# EAGLE design relay_Board (EAGLE 8.0.0)
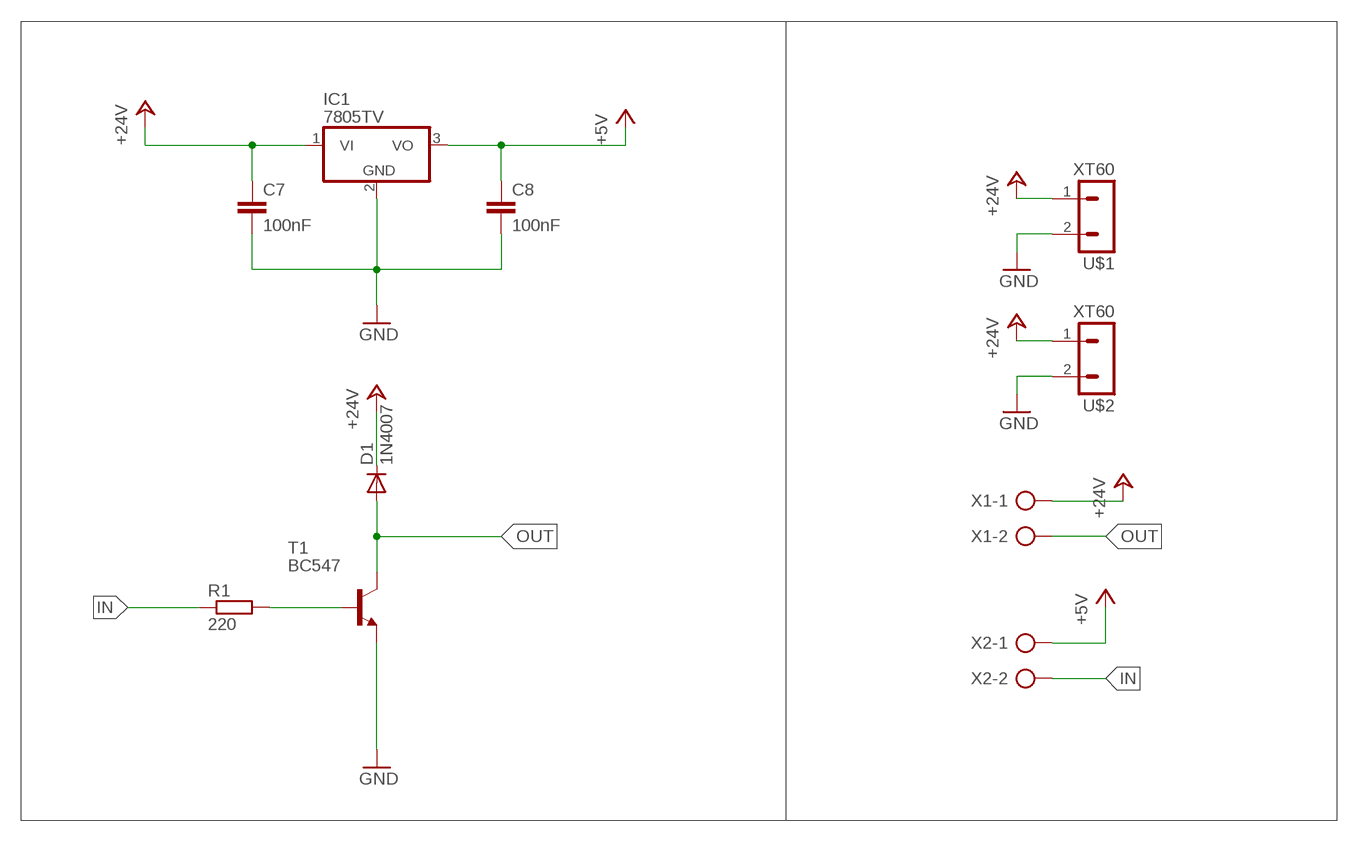
[diagram p0: schematic, sheet 1]

## Parts
C7  100nF  C5/5  [C5B5]
C8  100nF  C5/5  [C5B5]
D1  1N4007  DIODE  [DIODE]
IC1  7805TV  [TO220V]
R1  220  RES  [0207/10]
T1  BC547  [TO92]
U$1  XT60  [XT60]
U$2  XT60  [XT60]
X1  AK500/2  [AK500/2]
X2  AK500/2  [AK500/2]

## Nets
+5V [usbvcc]: C8.1 IC1.3(VO) X2.1
+24V: C7.1 D1.C IC1.1(VI) U$1.1 U$2.1 X1.1
GND: C7.2 C8.2 IC1.2(GND) T1.1(E) U$1.2 U$2.2
IN: R1.1 X2.2
N$1: R1.2 T1.2(B)
OUT: D1.A T1.3(C) X1.2

## Library data of the parts
C7 C8 = capacitor-wima:C: CAPACITOR naming: grid - package width
D1 = ZYBOTS:DIODE
IC1 = linear:78*: Positive VOLTAGE REGULATOR Source: http://cache.national.com/ds/LM/LM78L05.pdf http://www.fairchildsemi.com/ds/LM/LM7805.pdf
R1 = ZYBOTS:RES
T1 = transistor:BC547: NPN TRANSISTOR
U$1 U$2 = ZYBOTS:XT60
X1 X2 = con-ptr500:AK500/2: CONNECTOR; OC_FARNELL: unknown; OC_NEWARK: unknown

## Net classes
2 gnd: width 0.305 mm, drill 0.559 mm, clearance 0.254 mm
3 usbvcc: width 0.508 mm, drill 0.61 mm, clearance 0.254 mm

## Board
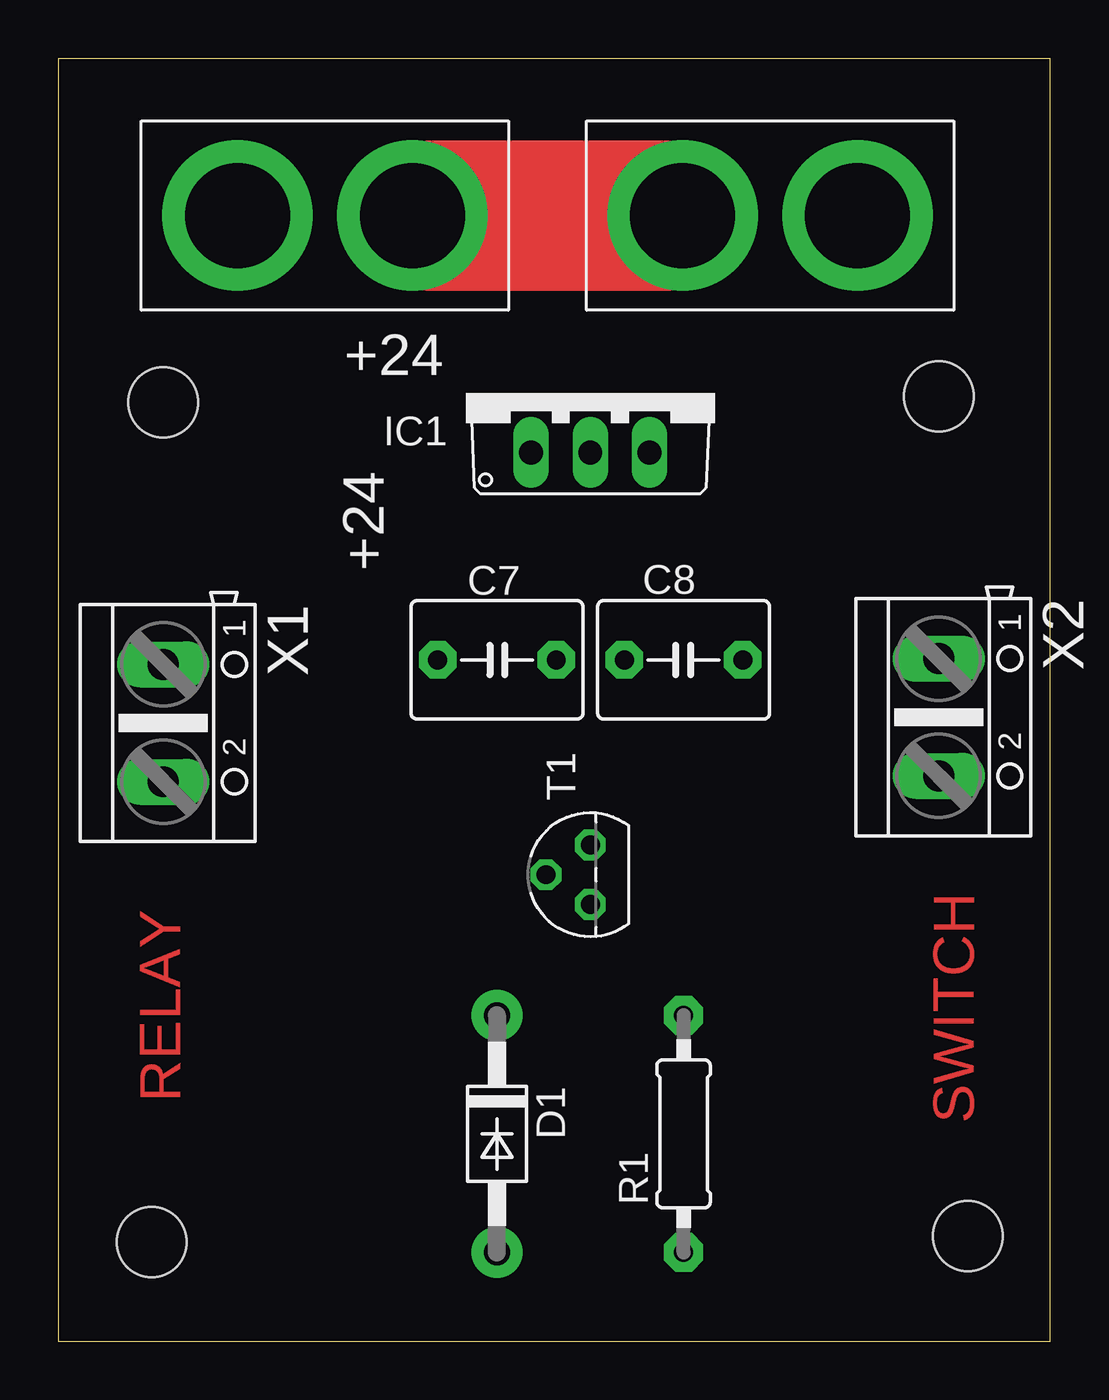
[diagram p1: board, top side]
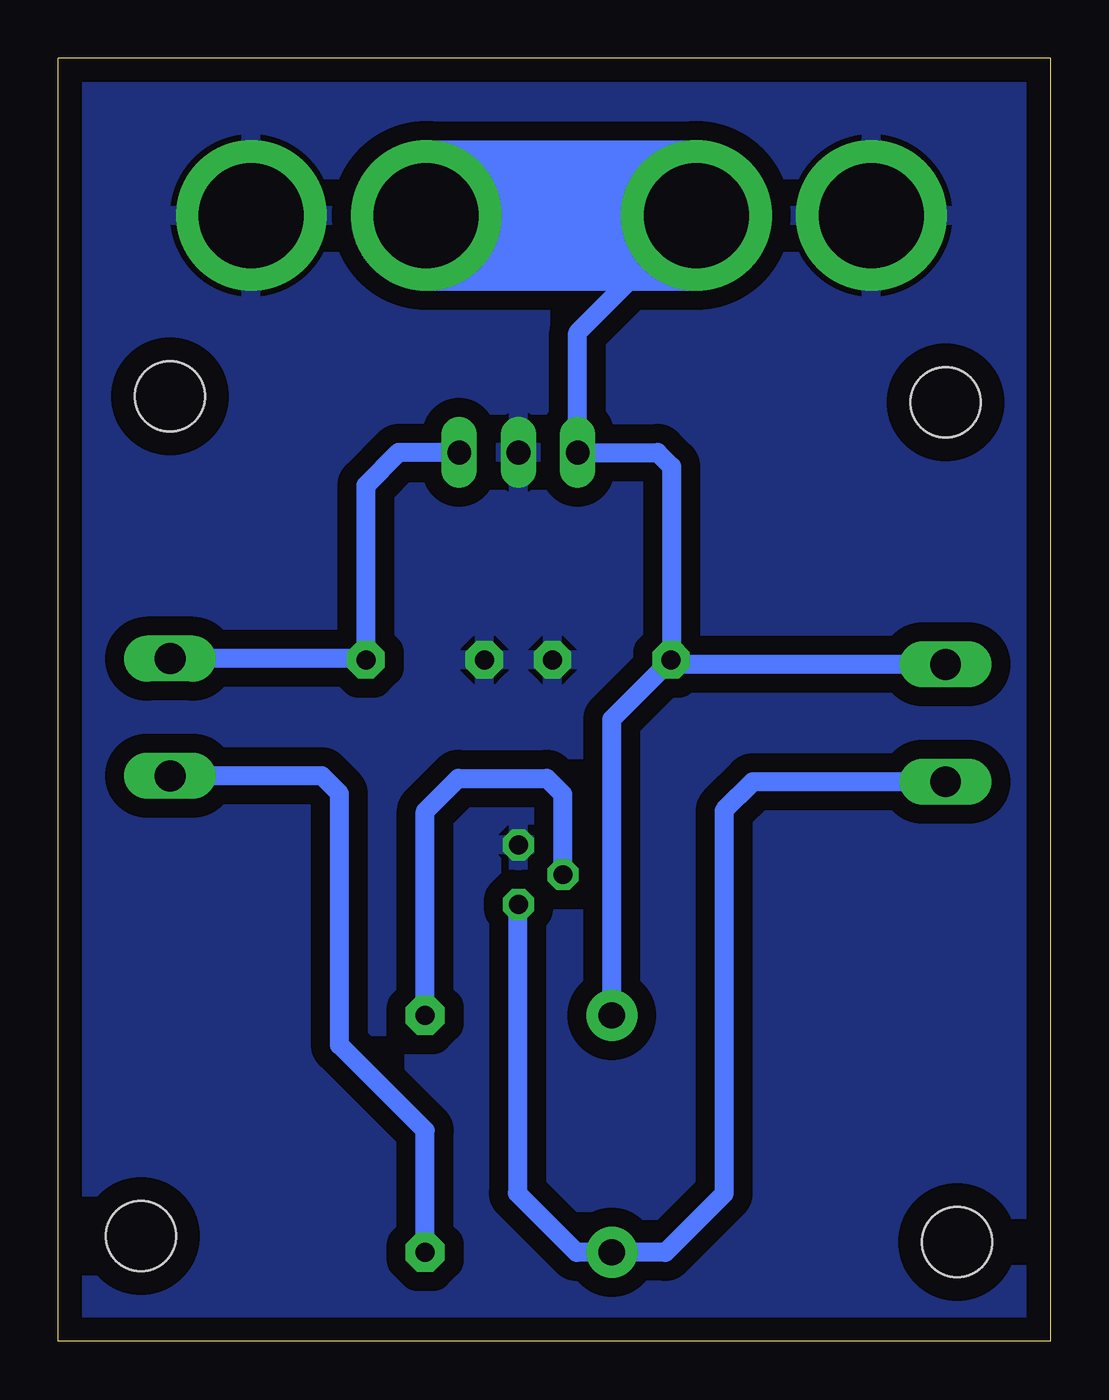
[diagram p2: board, bottom side, seen from below]

Size 42.54 x 55 mm. Coordinates in mm from the lower left corner, seen from the top.
Outline: 0,0 42.54,0 42.54,55 0,55 0,0
Copper layers (1*16): Top 0.035mm / dielectric 1.5mm / Bottom 0.035mm
Design rules "default": minimum track width 10mil, minimum drill 24mil, track to track 8mil, track to pad 8mil, pad to pad 8mil, via to via 8mil, smd to smd 8mil, copper to edge 40mil, drill to drill 8mil, minimum pad ring 10mil, minimum via ring 8mil, stop-mask expansion 4mil, vias tented up to drill 0mil, thermal gap 10mil
Holes 3 mm at 4,4.25 39,4.5 4.5,40.25 37.75,40.5

### Footprints (pad centres in the part's own frame; a part is rotated, then mirrored left to right if it is on the bottom)
C5B5 = drill 0.813 pad 1.6 octagon: 1 -2.54,0; 2 2.54,0
DIODE = drill 1.118 pad 2.184: A 5.08,0; C -5.08,0
TO220V = drill 1.016 long: 1 -2.54,-2.54; 2 0,-2.54; 3 2.54,-2.54
0207/10 = drill 0.813 pad 1.676 octagon: 1 -5.08,0; 2 5.08,0
TO92 = drill 0.813 octagon: 1 1.27,0; 2 0,1.905; 3 -1.27,0
XT60 = drill 4.5 pad 6.452: 1 -3.75,0; 2 3.75,0
AK500/2 = drill 1.321 long: 1 -2.515,0; 2 2.515,0

### Placement (x,y rotation side)
C7  18.81,29.21 0 top
C8  26.81,29.21 180 top
D1  18.81,8.89 270 top
IC1  22.81,40.64 0 top
R1  26.81,8.89 90 top
T1  22.81,20 90 top
U$1  11.43,48.26 180 top
U$2  30.52,48.26 0 top
X1  4.5,26.5 270 top
X2  37.75,26.75 270 top

### Tracks (layer width: path | path; a pad name or v marks a point on that pad's centre or on a via)
+5V
  Bottom 0.813: IC1.3 27.94,38.1 29.35,36.69 C8.1 29.41,29.27 X2.1
+24V
  Bottom 0.813: D1.C 18.81,26.67 C7.1 | U$1.1 15.24,48.26 20.27,43.23 IC1.1 16.85,38.1 16.25,37.5 16.25,29.23 C7.1 | X1.1 16.27,29.02 C7.1
  Bottom 6.452: U$1.1 U$2.1
GND
  pour Bottom (isolate 0.813): -1.27,55 -1.27,0 44,0 44,55
IN
  Bottom 0.813: R1.1 26.81,9.03 30.48,12.7 30.48,23.48 31.23,24.23 X2.2
N$1
  Bottom 0.813: R1.2 26.81,22.72 25.4,24.13 21.59,24.13 20.91,23.45 T1.2
N$2
  Top 6.452: 16,48.26 26,48.26
OUT
  Bottom 0.813: X1.2 12.77,23.98 14,22.75 14,6.32 16.51,3.81 D1.A 20.32,3.81 22.86,6.35 22.86,18.68 T1.3

### Text on the board
Top: SWITCH | RELAY
tPlace: +24 | +24